# Altium project 电源管理.PrjPCB
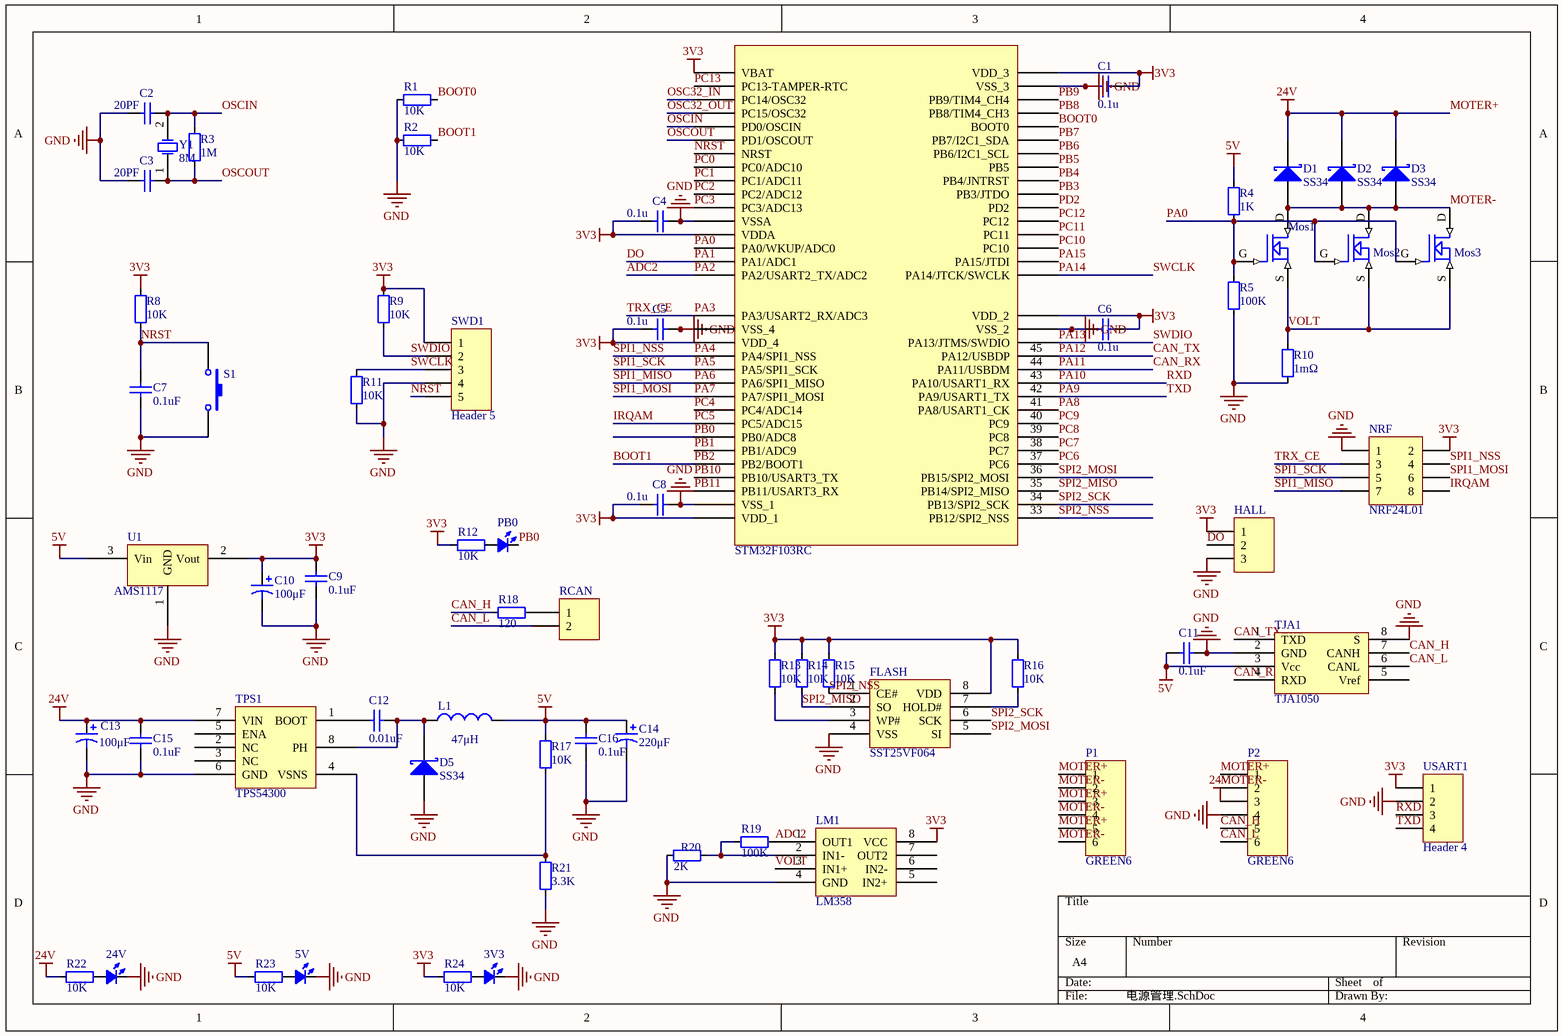
[diagram p0: 电源管理.SchDoc]
1 sheet, 65 parts. Net scope: global (net labels, ports and power ports of the same name join across sheets).
Board file: 电源管理.PcbDoc

## Sheet 电源管理.SchDoc
size A4

### Parts
3V3  LED_0603  [LED_0805_GREEN]  (value not drawn)
5V  LED_0603  [LED_0805_GREEN]  (value not drawn)
24V  LED_0603  [LED_0805_GREEN]  (value not drawn)
C1  value 0.1u  [CAP-MLCC-0603]  (hidden comment: Cap)
C2  value 20PF  [CAP-MLCC-0603]  (hidden comment: Cap)
C3  value 20PF  [CAP-MLCC-0603]  (hidden comment: Cap)
C4  value 0.1u  [CAP-MLCC-0603]  (hidden comment: Cap)
C5  value 0.1u  [CAP-MLCC-0603]  (hidden comment: Cap)
C6  value 0.1u  [CAP-MLCC-0603]  (hidden comment: Cap)
C7  value 0.1uF  [CAP-MLCC-0603]  (hidden comment: Cap)
C8  value 0.1u  [CAP-MLCC-0603]  (hidden comment: Cap)
C9  value 0.1uF  [CAP-MLCC-0603]  (hidden comment: Cap)
C10  100μF  [CAP-TAN-3216/CAPA]
C11  value 0.1uF  [CAP-MLCC-0603]  (hidden comment: Cap)
C12  value 0.01uF  [CAP-MLCC-0603]  (hidden comment: Cap)
C13  100μF  [C5]
C14  220μF  [CAP-TAN-7343/CAPD]
C15  value 0.1uF  [CAP-MLCC-0603]  (hidden comment: Cap)
C16  value 0.1uF  [CAP-MLCC-0603]  (hidden comment: Cap)
D1  SS34  [DO-214AC]
D2  SS34  [DO-214AC]
D3  SS34  [DO-214AC]
D5  SS34  [DO-214AC]
FLASH  SST25VF064  [SOIC_E200_8]
HALL  Header 3  [HDR1X3]  (value not drawn)
L1  value 47μH  [IND_CD32]  (hidden comment: Inductor)
LM1  LM358  [SOP_E150_8]
Mos1  MOSFET N  [TO-252AA]  (value not drawn)
Mos2  MOSFET N  [TO-252AA]  (value not drawn)
Mos3  MOSFET N  [TO-252AA]  (value not drawn)
NRF  NRF24L01  [HDR2X4]
P1  GREEN6  [Green_6P]
P2  GREEN6  [Green_6P]
PB0  LED_0603  [LED_0805_GREEN]  (value not drawn)
R1  value 10K  [RES-0603]  (hidden comment: Res_0603)
R2  value 10K  [RES-0603]  (hidden comment: Res_0603)
R3  value 1M  [RES-0603]  (hidden comment: Res_0603)
R4  value 1K  [RES-0603]  (hidden comment: Res_0603)
R5  value 100K  [RES-0603]  (hidden comment: Res_0603)
R8  value 10K  [RES-0603]  (hidden comment: Res_0603)
R9  value 10K  [RES-0603]  (hidden comment: Res_0603)
R10  value 1mΩ  [RESC6332]  (hidden comment: Res_0603)
R11  value 10K  [RES-0603]  (hidden comment: Res_0603)
R12  value 10K  [RES-0603]  (hidden comment: Res_0603)
R13  value 10K  [RES-0603]  (hidden comment: Res_0603)
R14  value 10K  [RES-0603]  (hidden comment: Res_0603)
R15  value 10K  [RES-0603]  (hidden comment: Res_0603)
R16  value 10K  [RES-0603]  (hidden comment: Res_0603)
R17  value 10K  [RES-0603]  (hidden comment: Res_0603)
R18  value 120  [RES-0603]  (hidden comment: Res_0603)
R19  value 100K  [RES-0603]  (hidden comment: Res_0603)
R20  value 2K  [RES-0603]  (hidden comment: Res_0603)
R21  value 3.3K  [RES-0603]  (hidden comment: Res_0603)
R22  value 10K  [RES-0603]  (hidden comment: Res_0603)
R23  value 10K  [RES-0603]  (hidden comment: Res_0603)
R24  value 10K  [RES-0603]  (hidden comment: Res_0603)
RCAN  (no value)  [HDR1X2]
S1  SW-PB  [KEY_SMD]  (value not drawn)
STM32F103RC  STM32F103RC  [LQFP_P0.5_64]  (value not drawn)
SWD1  Header 5  [HDR1X5]
TJA1  TJA1050  [TJA1050]
TPS1  TPS54300  [SOP_E150_8]
U1  AMS1117  [SOT223-3]
USART1  Header 4  [HDR1X4]
Y1  8M  [Osc-6032]

### Nets
3V3: C1.1 C4.1 C5.1 C6.1 C8.1 C9.2 C10.1 FLASH.8(VDD) HALL.1 LM1.8(VCC) NRF.2 R8.2 R9.2 R12.2 R13.2 R14.2 R15.2 R16.2 R24.2 STM32F103RC.1(VBAT) STM32F103RC.13(VDDA) STM32F103RC.19(VDD_4) STM32F103RC.32(VDD_1) STM32F103RC.48(VDD_2) STM32F103RC.64(VDD_3) SWD1.1 U1.2(Vout) USART1.1
5V: C11.1 C14.1 C16.2 L1.2 R4.2 R17.2 R23.2 TJA1.3(Vcc) U1.3(Vin)
GND: 3V3.2(K) 5V.2(K) 24V.2(K) C1.2 C2.1 C3.1 C4.2 C5.2 C6.2 C7.2 C8.2 C9.1 C10.2 C11.2 C13.2 C14.2 C15.1 C16.1 D5.1(A) FLASH.4(VSS) HALL.3 LM1.4(GND) NRF.1 P2.4 R1.2 R2.2 R5.1 R10.1 R11.1 R20.1 R21.2 S1.2 STM32F103RC.12(VSSA) STM32F103RC.18(VSS_4) STM32F103RC.31(VSS_1) STM32F103RC.47(VSS_2) STM32F103RC.63(VSS_3) SWD1.4 TJA1.2(GND) TJA1.8(S) TPS1.6(GND) U1.1(GND) USART1.2
MOTER+: C13.1 C15.2 D1.2(K) D2.2(K) D3.2(K) P1.1 P1.3 P1.5 P2.1 P2.3 R22.2 TPS1.7(VIN)  [also labelled 24V]
ADC2: LM1.1(OUT1) R19.2 STM32F103RC.16(PA2/USART2_TX/ADC2)  [also labelled PA2]
BOOT0: R1.1 STM32F103RC.60(BOOT0)
BOOT1: R2.1 STM32F103RC.28(PB2/BOOT1)  [also labelled PB2]
CAN_H: P2.5 R18.2 TJA1.7(CANH)
CAN_L: P2.6 RCAN.2 TJA1.6(CANL)
CAN_RX: STM32F103RC.44(PA11/USBDM) TJA1.4(RXD)  [also labelled PA11]
CAN_TX: STM32F103RC.45(PA12/USBDP) TJA1.1(TXD)  [also labelled PA12]
DO: HALL.2 STM32F103RC.15(PA1/ADC1)  [also labelled PA1]
IRQAM: NRF.8 STM32F103RC.25(PC5/ADC15)  [also labelled PC5]
MOTER-: D1.1(A) D2.1(A) D3.1(A) Mos1.D Mos2.D Mos3.D P1.2 P1.4 P1.6 P2.2
NRST: C7.1 R8.1 S1.1 STM32F103RC.7(NRST) SWD1.5
OSC32_IN: STM32F103RC.3(PC14/OSC32)
OSC32_OUT: STM32F103RC.4(PC15/OSC32)
OSCIN: C2.2 R3.2 STM32F103RC.5(PD0/OSCIN) Y1.2(OSC2)
OSCOUT: C3.2 R3.1 STM32F103RC.6(PD1/OSCOUT) Y1.1(OSC1)
PA0: Mos1.G Mos2.G Mos3.G R4.1 R5.2 STM32F103RC.14(PA0/WKUP/ADC0)
PA3: NRF.3 STM32F103RC.17(PA3/USART2_RX/ADC3)  [also labelled TRX_CE]
PA4: NRF.4 STM32F103RC.20(PA4/SPI1_NSS)  [also labelled SPI1_NSS]
PA5: NRF.5 STM32F103RC.21(PA5/SPI1_SCK)  [also labelled SPI1_SCK]
PA6: NRF.7 STM32F103RC.22(PA6/SPI1_MISO)  [also labelled SPI1_MISO]
PA7: NRF.6 STM32F103RC.23(PA7/SPI1_MOSI)  [also labelled SPI1_MOSI]
PA8: STM32F103RC.41(PA8/USART1_CK)
PA9: STM32F103RC.42(PA9/USART1_TX) USART1.4  [also labelled TXD]
PA10: STM32F103RC.43(PA10/USART1_RX) USART1.3  [also labelled RXD]
PA13: R9.1 STM32F103RC.46(PA13/JTMS/SWDIO) SWD1.2  [also labelled SWDIO]
PA14: R11.2 STM32F103RC.49(PA14/JTCK/SWCLK) SWD1.3  [also labelled SWCLK]
PA15: STM32F103RC.50(PA15/JTDI)
PB0: PB0.2(K) STM32F103RC.26(PB0/ADC8)
PB1: STM32F103RC.27(PB1/ADC9)
PB3: STM32F103RC.55(PB3/JTDO)
PB4: STM32F103RC.56(PB4/JNTRST)
PB5: STM32F103RC.57(PB5)
PB6: STM32F103RC.58(PB6/I2C1_SCL)
PB7: STM32F103RC.59(PB7/I2C1_SDA)
PB8: STM32F103RC.61(PB8/TIM4_CH3)
PB9: STM32F103RC.62(PB9/TIM4_CH4)
PB10: STM32F103RC.29(PB10/USART3_TX)
PB11: STM32F103RC.30(PB11/USART3_RX)
PC0: STM32F103RC.8(PC0/ADC10)
PC1: STM32F103RC.9(PC1/ADC11)
PC2: STM32F103RC.10(PC2/ADC12)
PC3: STM32F103RC.11(PC3/ADC13)
PC4: STM32F103RC.24(PC4/ADC14)
PC6: STM32F103RC.37(PC6)
PC7: STM32F103RC.38(PC7)
PC8: STM32F103RC.39(PC8)
PC9: STM32F103RC.40(PC9)
PC10: STM32F103RC.51(PC10)
PC11: STM32F103RC.52(PC11)
PC12: STM32F103RC.53(PC12)
PC13: STM32F103RC.2(PC13-TAMPER-RTC)
PD2: STM32F103RC.54(PD2)
SPI2_MISO: FLASH.2(SO) R14.1 STM32F103RC.35(PB14/SPI2_MISO)
SPI2_MOSI: FLASH.5(SI) STM32F103RC.36(PB15/SPI2_MOSI)
SPI2_NSS: FLASH.1(CE#) R15.1 STM32F103RC.33(PB12/SPI2_NSS)
SPI2_SCK: FLASH.6(SCK) STM32F103RC.34(PB13/SPI2_SCK)
VOLT: LM1.3(IN1+) Mos1.S Mos2.S Mos3.S R10.2
Net3V3_1: 3V3.1(A) R24.1
Net5V_1: 5V.1(A) R23.1
Net24V_1: 24V.1(A) R22.1
NetC12_1: C12.1 D5.2(K) L1.1 TPS1.8(PH)
NetC12_2: C12.2 TPS1.1(BOOT)
NetFLASH_3: FLASH.3(WP#) R13.1
NetFLASH_7: FLASH.7(HOLD#) R16.1
NetLM1_2: LM1.2(IN1-) R19.1 R20.2
NetPB0_1: PB0.1(A) R12.1
NetR17_1: R17.1 R21.1 TPS1.4(VSNS)
NetR18_1: R18.1 RCAN.1

Not connected (* = marked no-connect by the designer): LM1 5(IN2+) 6(IN2-) 7(OUT2); TJA1 5(Vref); TPS1 2(NC) 3(NC) 5(ENA)

### Library data of the parts
3V3 5V 24V PB0 = LED_0603: LED
C1-C6 C8 = Cap_1: Capacitor; Published: 8-Jun-2000; LatestRevisionDate: 17-Jul-2002; LatestRevisionNote: Re-released for DXP Platform.; PackageReference: RAD-0.3; Publisher: Altium Limited
C7 C9 C11 C12 C15 C16 = Cap: Capacitor; Published: 8-Jun-2000; LatestRevisionDate: 17-Jul-2002; LatestRevisionNote: Re-released for DXP Platform.; PackageReference: RAD-0.3; Publisher: Altium Limited
C10 C13 C14 = CAP-TAN: 钽电容; Value: *μF; Published: 8-Jun-2000; LatestRevisionDate: 17-Jul-2002; LatestRevisionNote: Re-released for DXP Platform.; PackageReference: POLAR0.8; Publisher: Altium Limited; PackageDescription: Polarized Capacitor; 2 Leads
D1-D3 D5 = DIODE-Schottky: 肖特基二极管; Value: 1N****; Published: 8-Jun-2000; LatestRevisionDate: 17-Jul-2002; LatestRevisionNote: Re-released for DXP Platform.; PackageReference: SMB; Publisher: Altium Limited; PackageDescription: DO-214-AA/SMB; 2 C-Bend Leads; Body 5.3 x 3.6 mm, inc. leads (LxW); Code_JEDEC: DO-214-AA
FLASH LM1 = Component_1
HALL = Header 3: Header, 3-Pin; LatestRevisionDate: 17-Jul-2002; LatestRevisionNote: Re-released for DXP Platform.; Publisher: Altium Limited
L1 = Inductor: Code_IEC: 1005; Published: 8-Jun-2000; LatestRevisionDate: 29-May-2009; LatestRevisionNote: IPC-7351 Footprint Added.; PackageReference: 0402-A; Publisher: Altium Limited; PackageDescription: Chip Inductor; Code_JEITA: 0402
Mos1-Mos3 = MOSFET N: MOS SOT23; pin to pad: D>4 G>1 S>3
NRF = MHDR2X4: Header, 4-Pin, Dual row; LatestRevisionDate: 17-Jul-2002; LatestRevisionNote: Re-released for DXP Platform.; Publisher: Altium Limited
P1 P2 = Header 6: Header, 6-Pin; LatestRevisionDate: 17-Jul-2002; LatestRevisionNote: Re-released for DXP Platform.; Publisher: Altium Limited
R1-R5 R8-R24 = Res_0603: Resistor
RCAN = Header 2: Header, 2-Pin; LatestRevisionDate: 17-Jul-2002; LatestRevisionNote: Re-released for DXP Platform.; Publisher: Altium Limited
S1 = SW-PB: 按钮; Published: 24-Mar-1999; LatestRevisionDate: 17-Jul-2002; LatestRevisionNote: Re-released for DXP Platform.; PackageReference: SPST-2; Publisher: Altium Limited; PackageDescription: Switch; 2 Leads
STM32F103RC = STM32F103RC: MCU
SWD1 = Header 5: Header, 5-Pin; LatestRevisionDate: 17-Jul-2002; LatestRevisionNote: Re-released for DXP Platform.; Publisher: Altium Limited
TJA1 = TJA1050: CAN总线收发器
U1 = AMS１１１７
USART1 = Header 4: Header, 4-Pin; LatestRevisionDate: 17-Jul-2002; LatestRevisionNote: Re-released for DXP Platform.; Publisher: Altium Limited
Y1 = C-Osc: Crystal Oscillator; Published: 8-Jun-2000; LatestRevisionDate: 17-Jul-2002; LatestRevisionNote: Re-released for DXP Platform.; PackageReference: R38; Publisher: Altium Limited; PackageDescription: Crystal, Thru-Hole; 2 Leads; Body 3.1 x 8.2 mm (Dia.xH)